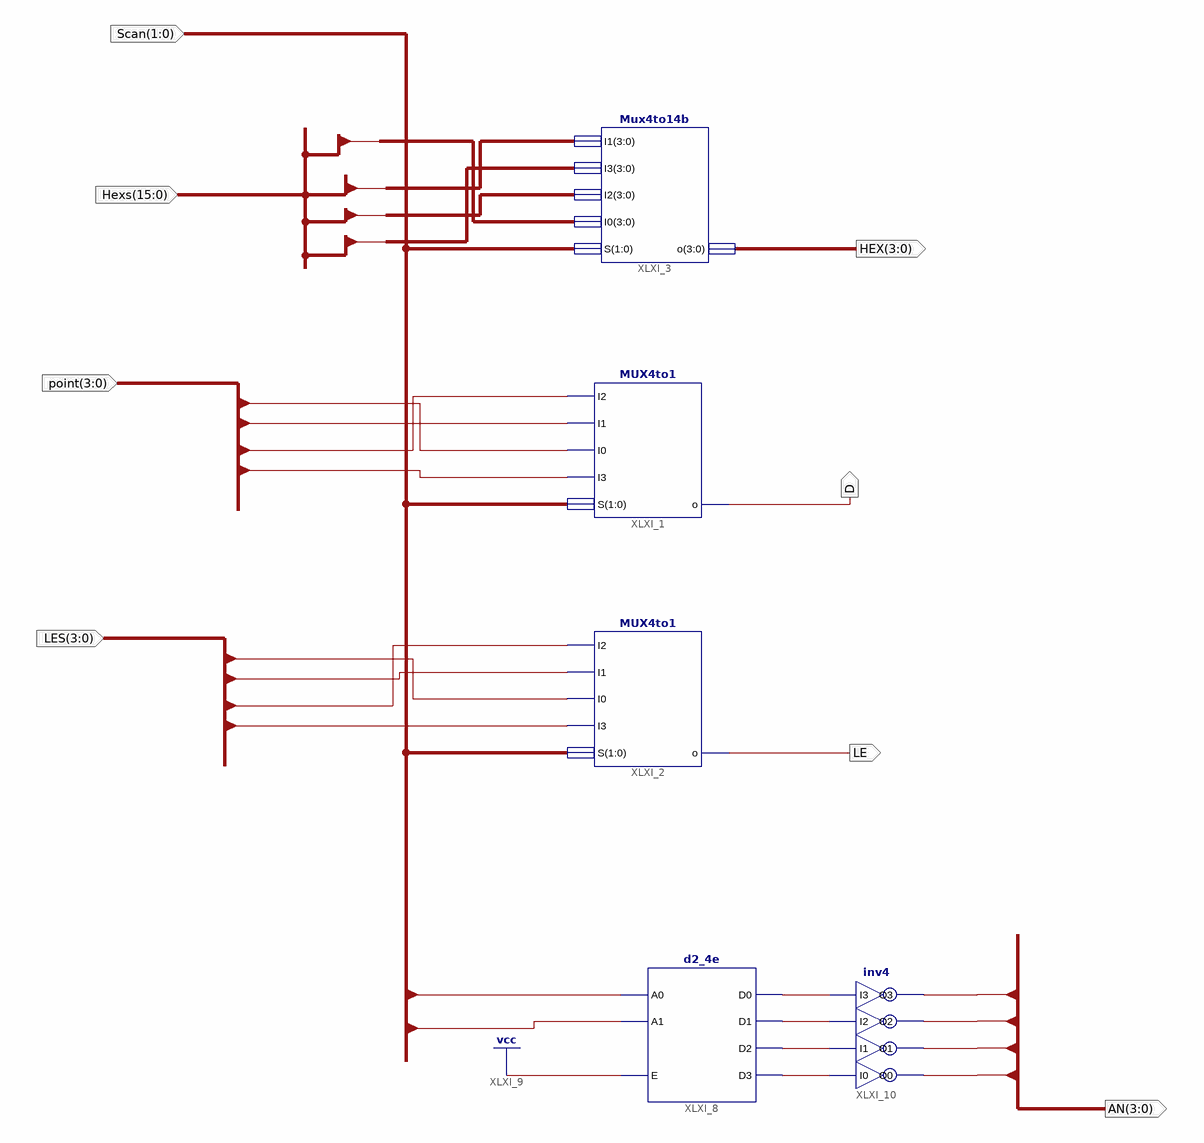
[diagram p0: schematic sheet 1]
// Xilinx ISE schematic DisplaySync.sch (kintex7) as structural Verilog: 5 symbols, 8 ports
module DisplaySync (
  input  [15:0] Hexs,
  input  [1:0] Scan,
  input  [3:0] point,
  input  [3:0] LES,
  output [3:0] HEX,
  output D,
  output LE,
  output [3:0] AN
);

  wire XLXN_30, XLXN_31, XLXN_32, XLXN_33;

  MUX4to1 XLXI_1 (.S(Scan), .I3(point[3]), .I0(point[0]), .I1(point[1]), .I2(point[2]), .o(D));
  MUX4to1 XLXI_2 (.S(Scan), .I3(LES[3]), .I0(LES[0]), .I1(LES[1]), .I2(LES[2]), .o(LE));
  Mux4to14b XLXI_3 (.S(Scan), .I0(Hexs[3:0]), .I2(Hexs[11:8]), .I3(Hexs[15:12]), .I1(Hexs[7:4]), .o(HEX));
  d2_4e XLXI_8 (.A0(Scan[0]), .A1(Scan[1]), .E(1'b1), .D0(XLXN_30), .D1(XLXN_31), .D2(XLXN_32), .D3(XLXN_33));
  inv4 XLXI_10 (.I0(XLXN_33), .I1(XLXN_32), .I2(XLXN_31), .I3(XLXN_30), .O0(AN[3]), .O1(AN[2]), .O2(AN[1]), .O3(AN[0]));
endmodule
